# EAGLE schematic ADAT DeEnkoder v2 (EAGLE 5.03)
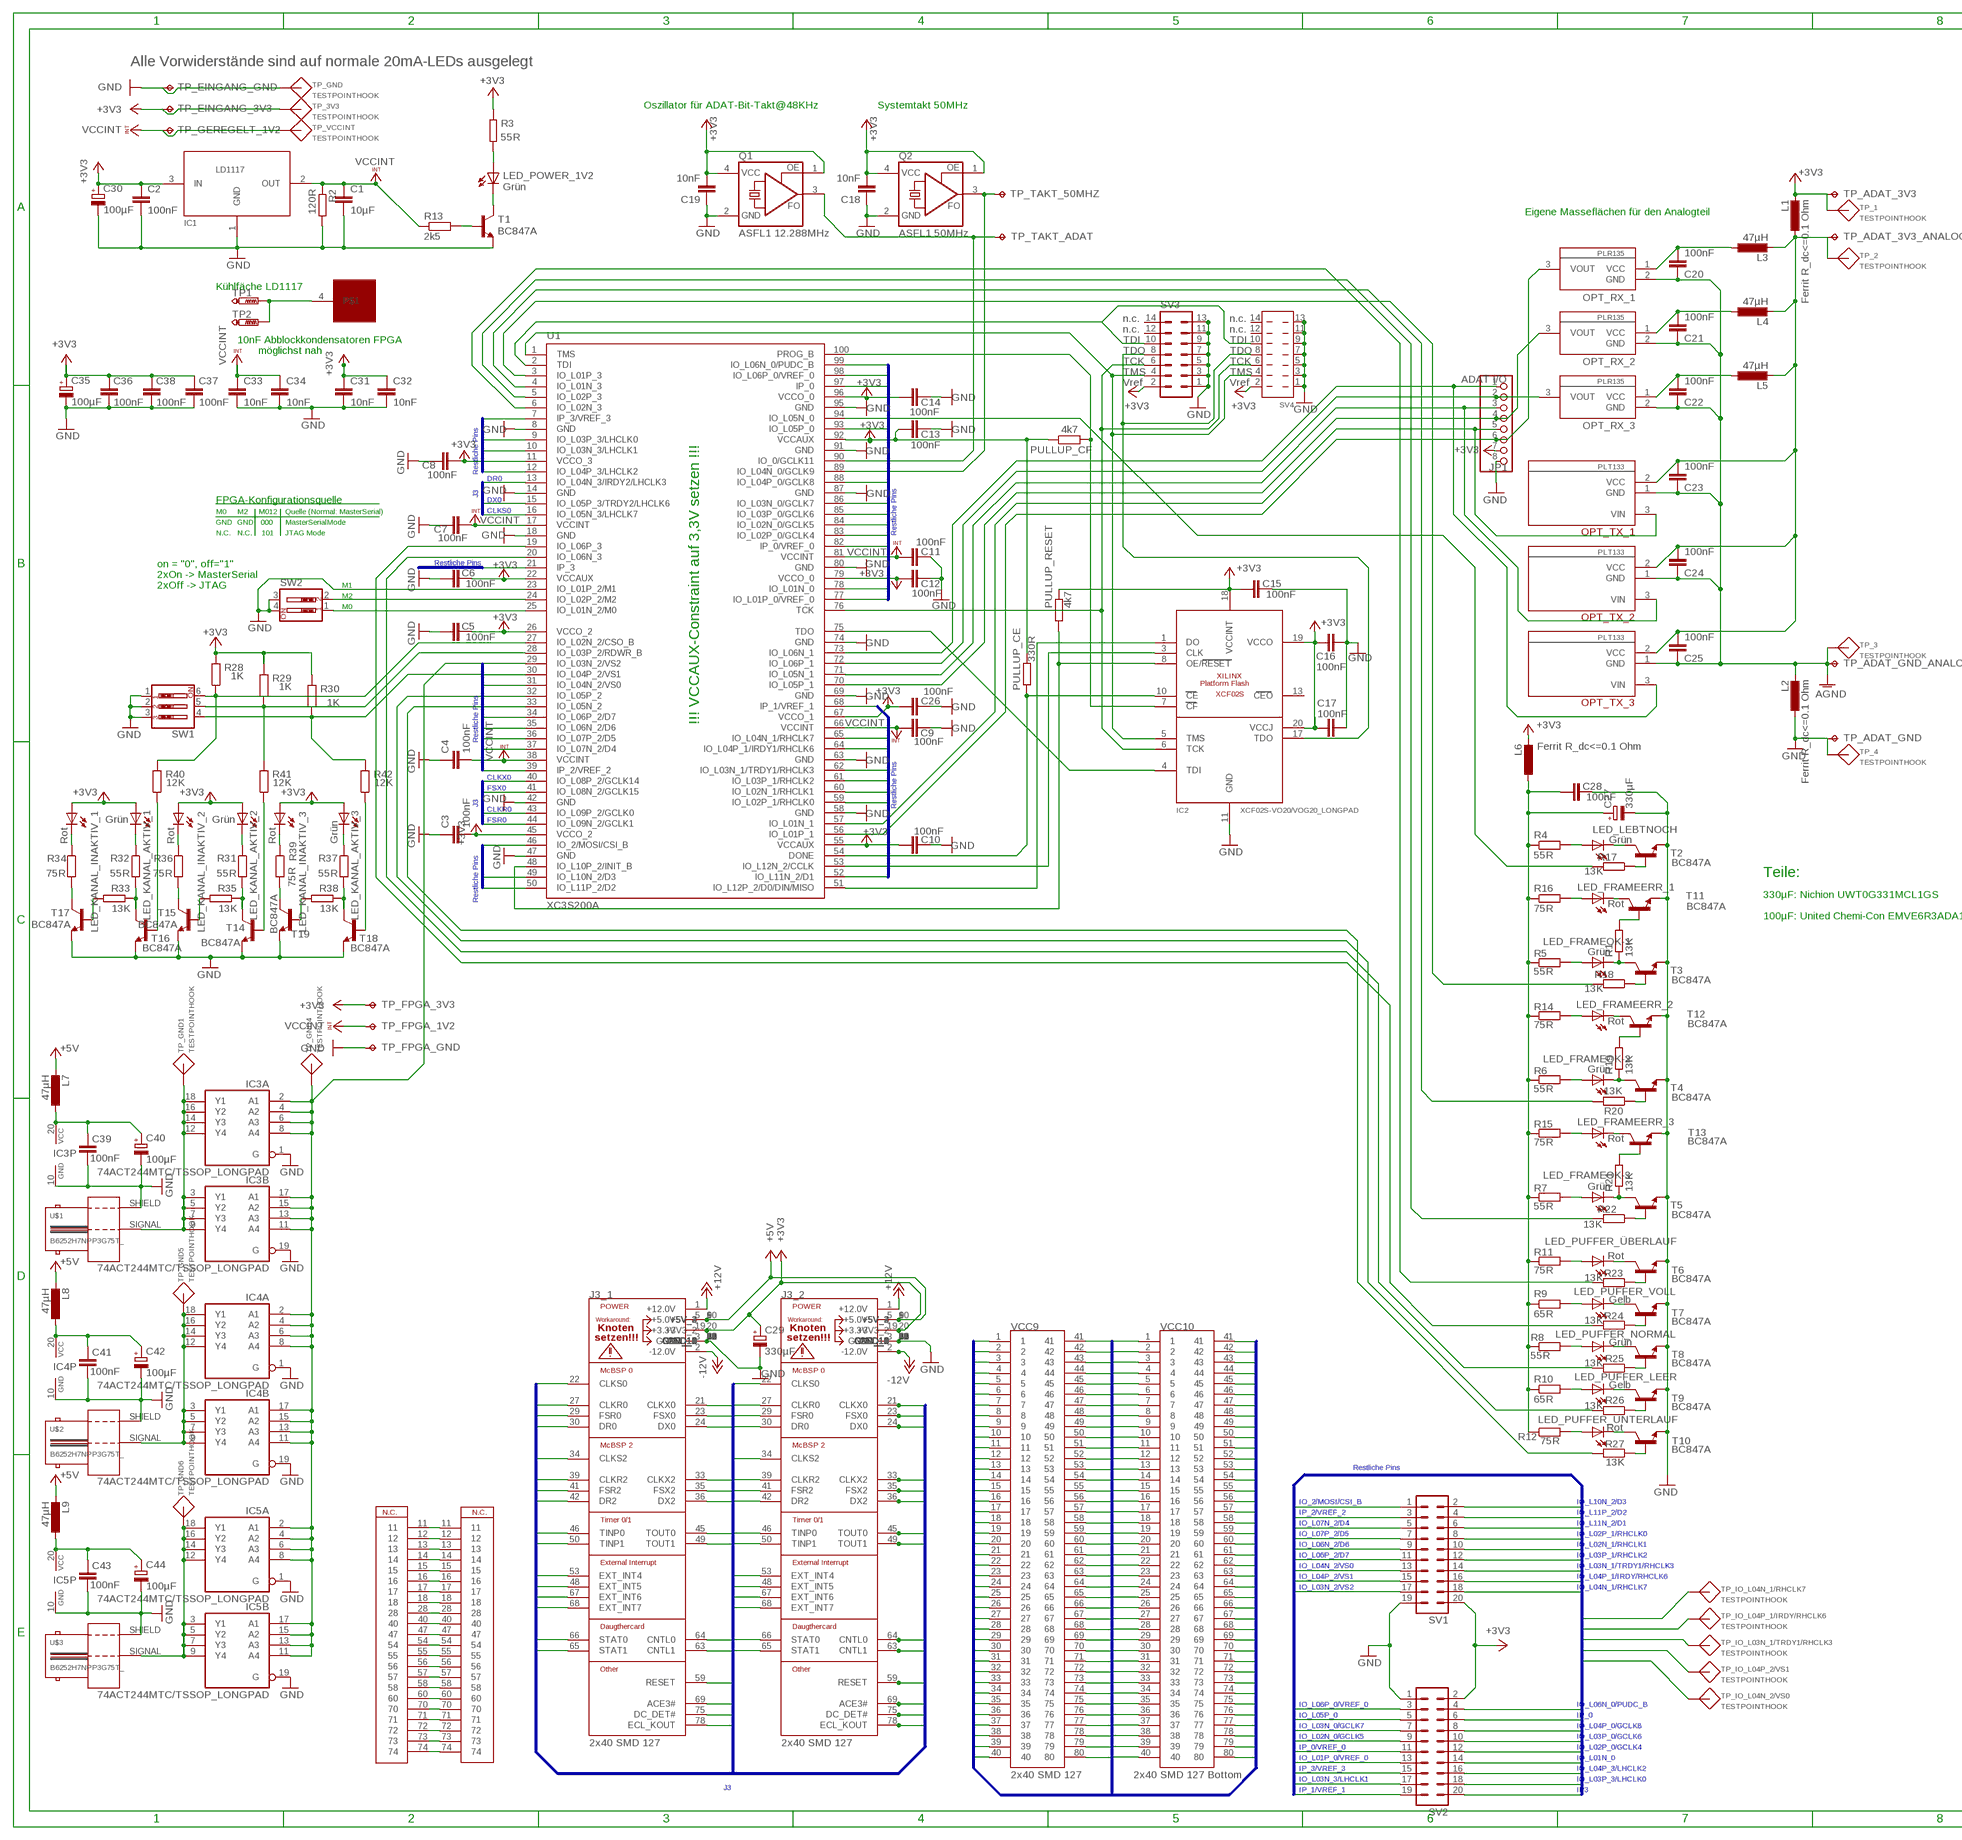
[diagram p0: schematic, sheet 1, part 1 of 2]
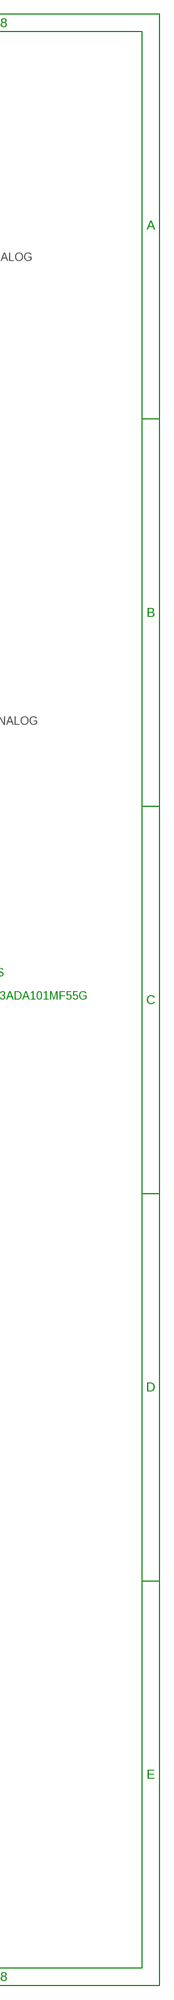
[diagram p1: schematic, sheet 1, part 2 of 2]

## Parts
C1  10µF  C-EUC0805  [C0805]
C2  100nF  C-EUC0603  [C0603]
C3  100nF  C-EUC0603  [C0603]
C4  100nF  C-EUC0603  [C0603]
C5  100nF  C-EUC0603  [C0603]
C6  100nF  C-EUC0603  [C0603]
C7  100nF  C-EUC0603  [C0603]
C8  100nF  C-EUC0603  [C0603]
C9  100nF  C-EUC0603  [C0603]
C10  100nF  C-EUC0603  [C0603]
C11  100nF  C-EUC0603  [C0603]
C12  100nF  C-EUC0603  [C0603]
C13  100nF  C-EUC0603  [C0603]
C14  100nF  C-EUC0603  [C0603]
C15  100nF  C-EUC0603  [C0603]
C16  100nF  C-EUC0603  [C0603]
C17  100nF  C-EUC0603  [C0603]
C18  10nF  C-EUC0603  [C0603]
C19  10nF  C-EUC0603  [C0603]
C20  100nF  C-EUC0603  [C0603]
C21  100nF  C-EUC0603  [C0603]
C22  100nF  C-EUC0603  [C0603]
C23  100nF  C-EUC0603  [C0603]
C24  100nF  C-EUC0603  [C0603]
C25  100nF  C-EUC0603  [C0603]
C26  100nF  C-EUC0603  [C0603]
C27  330µF  ELKO-SMDLONG_PADS  [6.3²_LONGPADS]
C28  100nF  C-EUC0603  [C0603]
C29  330µF  ELKO-SMDLONG_PADS  [6.3²_LONGPADS]
C30  100µF  ELKO-SMD6.3MM  [6.3²]
C31  10nF  C-EUC0603  [C0603]
C32  10nF  C-EUC0603  [C0603]
C33  10nF  C-EUC0603  [C0603]
C34  10nF  C-EUC0603  [C0603]
C35  100µF  ELKO-SMDLONG_PADS  [6.3²_LONGPADS]
C36  100nF  C-EUC0603  [C0603]
C37  100nF  C-EUC0603  [C0603]
C38  100nF  C-EUC0603  [C0603]
C39  100nF  C-EUC0603  [C0603]
C40  100µF  ELKO-SMDLONG_PADS  [6.3²_LONGPADS]
C41  100nF  C-EUC0603  [C0603]
C42  100µF  ELKO-SMDLONG_PADS  [6.3²_LONGPADS]
C43  100nF  C-EUC0603  [C0603]
C44  100µF  ELKO-SMDLONG_PADS  [6.3²_LONGPADS]
IC1  LD1117S  [SOT223]
IC2  XCF02S-VO20/VOG20_LONGPAD  [TSSOP20_LONGPAD]
IC3  74ACT244MTC/TSSOP_LONGPAD  [TSSOP20_LONGPAD]
IC4  74ACT244MTC/TSSOP_LONGPAD  [TSSOP20_LONGPAD]
IC5  74ACT244MTC/TSSOP_LONGPAD  [TSSOP20_LONGPAD]
J3_1  J3_2X40SMD127_TOP  [J3_2X40SMD_TOP]
J3_2  J3_2X40SMD127_BOTTOM  [J3_2X40SMD_BOTTOM]
JP1  ADAT I/O  PINHD-1X8  [1X08]
L1  Ferrit R_dc<=0.1 Ohm  L-EUL2012C  [L2012C]
L2  Ferrit R_dc<=0.1 Ohm  L-EUL2012C  [L2012C]
L3  47µH  L-EU2518_(1007_IMP)_LONGPAD  [1007_(2518METR.)_LONGPAD]
L4  47µH  L-EU2518_(1007_IMP)_LONGPAD  [1007_(2518METR.)_LONGPAD]
L5  47µH  L-EU2518_(1007_IMP)_LONGPAD  [1007_(2518METR.)_LONGPAD]
L6  Ferrit R_dc<=0.1 Ohm  L-EUL2012C  [L2012C]
L7  47µH  L-EU2518_(1007_IMP)_LONGPAD  [1007_(2518METR.)_LONGPAD]
L8  47µH  L-EU2518_(1007_IMP)_LONGPAD  [1007_(2518METR.)_LONGPAD]
L9  47µH  L-EU2518_(1007_IMP)_LONGPAD  [1007_(2518METR.)_LONGPAD]
LED_FRAMEERR_1  Rot  LEDCHIPLED_0805  [CHIPLED_0805]
LED_FRAMEERR_2  Rot  LEDCHIPLED_0805  [CHIPLED_0805]
LED_FRAMEERR_3  Rot  LEDCHIPLED_0805  [CHIPLED_0805]
LED_FRAMEOK-1  Grün  LEDCHIPLED_0805  [CHIPLED_0805]
LED_FRAMEOK-2  Grün  LEDCHIPLED_0805  [CHIPLED_0805]
LED_FRAMEOK-3  Grün  LEDCHIPLED_0805  [CHIPLED_0805]
LED_KANAL_AKTIV_1  Grün  LEDCHIPLED_0805  [CHIPLED_0805]
LED_KANAL_AKTIV_2  Grün  LEDCHIPLED_0805  [CHIPLED_0805]
LED_KANAL_AKTIV_3  Grün  LEDCHIPLED_0805  [CHIPLED_0805]
LED_KANAL_INAKTIV_1  Rot  LEDCHIPLED_0805  [CHIPLED_0805]
LED_KANAL_INAKTIV_2  Rot  LEDCHIPLED_0805  [CHIPLED_0805]
LED_KANAL_INAKTIV_3  Rot  LEDCHIPLED_0805  [CHIPLED_0805]
LED_LEBTNOCH  Grün  LEDCHIPLED_0805  [CHIPLED_0805]
LED_POWER_1V2  Grün  LEDCHIPLED_0805  [CHIPLED_0805]
LED_PUFFER_LEER  Gelb  LEDCHIPLED_0805  [CHIPLED_0805]
LED_PUFFER_NORMAL  Grün  LEDCHIPLED_0805  [CHIPLED_0805]
LED_PUFFER_UNTERLAUF  Rot  LEDCHIPLED_0805  [CHIPLED_0805]
LED_PUFFER_VOLL  Gelb  LEDCHIPLED_0805  [CHIPLED_0805]
LED_PUFFER_ÜBERLAUF  Rot  LEDCHIPLED_0805  [CHIPLED_0805]
OPT_RX_1  PLR135/T  [T]
OPT_RX_2  PLR135/T  [T]
OPT_RX_3  PLR135/T  [T]
OPT_TX_1  PLT133  [PLT133]
OPT_TX_2  PLT133  [PLT133]
OPT_TX_3  PLT133  [PLT133]
PULLUP_CE  330R  R-EU_R0805  [R0805]
PULLUP_CF  4k7  R-EU_R0805  [R0805]
PULLUP_RESET  4k7  R-EU_R0805  [R0805]
Q1  ASFL1 12.288MHz  ASFL1  [ASF]
Q2  ASFL1 50MHz  ASFL1  [ASF]
R1  13K  R-EU_R0805  [R0805]
R2  120R  R-EU_R0805  [R0805]
R3  55R  R-EU_R0805  [R0805]
R4  55R  R-EU_R0805  [R0805]
R5  55R  R-EU_R0805  [R0805]
R6  55R  R-EU_R0805  [R0805]
R7  55R  R-EU_R0805  [R0805]
R8  55R  R-EU_R0805  [R0805]
R9  65R  R-EU_R0805  [R0805]
R10  65R  R-EU_R0805  [R0805]
R11  75R  R-EU_R0805  [R0805]
R12  75R  R-EU_R0805  [R0805]
R13  2k5  R-EU_R0805  [R0805]
R14  75R  R-EU_R0805  [R0805]
R15  75R  R-EU_R0805  [R0805]
R16  75R  R-EU_R0805  [R0805]
R17  13K  R-EU_R0805  [R0805]
R18  13K  R-EU_R0805  [R0805]
R19  13K  R-EU_R0805  [R0805]
R20  13K  R-EU_R0805  [R0805]
R21  13K  R-EU_R0805  [R0805]
R22  13K  R-EU_R0805  [R0805]
R23  13K  R-EU_R0805  [R0805]
R24  13K  R-EU_R0805  [R0805]
R25  13K  R-EU_R0805  [R0805]
R26  13K  R-EU_R0805  [R0805]
R27  13K  R-EU_R0805  [R0805]
R28  1K  R-EU_R0805  [R0805]
R29  1K  R-EU_R0805  [R0805]
R30  1K  R-EU_R0805  [R0805]
R31  55R  R-EU_R0805  [R0805]
R32  55R  R-EU_R0805  [R0805]
R33  13K  R-EU_R0805  [R0805]
R34  75R  R-EU_R0805  [R0805]
R35  13K  R-EU_R0805  [R0805]
R36  75R  R-EU_R0805  [R0805]
R37  55R  R-EU_R0805  [R0805]
R38  13K  R-EU_R0805  [R0805]
R39  75R  R-EU_R0805  [R0805]
R40  12K  R-EU_R0805  [R0805]
R41  12K  R-EU_R0805  [R0805]
R42  12K  R-EU_R0805  [R0805]
SV1  ML20_ROUND-PADS  [ML20_ROUND_PAD]
SV2  ML20_ROUND-PADS  [ML20_ROUND_PAD]
SV3  ML14_RUNDE-PINS  [ML14_ROUND_PAD]
SV4  87831-1420  [87831-1420]
SW1  SW_DIP-3  [EDG-03]
SW2  SW_DIP-2  [EDG-02]
T1  BC847A  BC847  [SOT23]
T2  BC847A  BC847  [SOT23]
T3  BC847A  BC847  [SOT23]
T4  BC847A  BC847  [SOT23]
T5  BC847A  BC847  [SOT23]
T6  BC847A  BC847  [SOT23]
T7  BC847A  BC847  [SOT23]
T8  BC847A  BC847  [SOT23]
T9  BC847A  BC847  [SOT23]
T10  BC847A  BC847  [SOT23]
T11  BC847A  BC847  [SOT23]
T12  BC847A  BC847  [SOT23]
T13  BC847A  BC847  [SOT23]
T14  BC847A  BC847  [SOT23]
T15  BC847A  BC847  [SOT23]
T16  BC847A  BC847  [SOT23]
T17  BC847A  BC847  [SOT23]
T18  BC847A  BC847  [SOT23]
T19  BC847A  BC847  [SOT23]
TP1  PTR1PAD1-20  [P1-20]
TP2  PTR1PAD1-20  [P1-20]
TP_1  TESTPOINTHOOK  [TESTPOINT-HOOK]
TP_2  TESTPOINTHOOK  [TESTPOINT-HOOK]
TP_3  TESTPOINTHOOK  [TESTPOINT-HOOK]
TP_3V3  TESTPOINTHOOK  [TESTPOINT-HOOK]
TP_4  TESTPOINTHOOK  [TESTPOINT-HOOK]
TP_ADAT_3V3  TPB2,54  [B2,54]
TP_ADAT_3V3_ANALOG  TPB2,54  [B2,54]
TP_ADAT_GND  TPB2,54  [B2,54]
TP_ADAT_GND_ANALOG  TPB2,54  [B2,54]
TP_EINGANG_3V3  TPB2,54  [B2,54]
TP_EINGANG_GND  TPB2,54  [B2,54]
TP_FPGA_1V2  TPB2,54  [B2,54]
TP_FPGA_3V3  TPB2,54  [B2,54]
TP_FPGA_GND  TPB2,54  [B2,54]
TP_GEREGELT_1V2  TPB2,54  [B2,54]
TP_GND  TESTPOINTHOOK  [TESTPOINT-HOOK]
TP_GND1  TESTPOINTHOOK  [TESTPOINT-HOOK]
TP_GND4  TESTPOINTHOOK  [TESTPOINT-HOOK]
TP_GND5  TESTPOINTHOOK  [TESTPOINT-HOOK]
TP_GND6  TESTPOINTHOOK  [TESTPOINT-HOOK]
TP_IO_L03N_1/TRDY1/RHCLK3  TESTPOINTHOOK  [TESTPOINT-HOOK]
TP_IO_L04N_1/RHCLK7  TESTPOINTHOOK  [TESTPOINT-HOOK]
TP_IO_L04N_2/VS0  TESTPOINTHOOK  [TESTPOINT-HOOK]
TP_IO_L04P_1/IRDY/RHCLK6  TESTPOINTHOOK  [TESTPOINT-HOOK]
TP_IO_L04P_2/VS1  TESTPOINTHOOK  [TESTPOINT-HOOK]
TP_TAKT_50MHZ  TPTP07SQ  [TP07SQ]
TP_TAKT_ADAT  TPTP07SQ  [TP07SQ]
TP_VCCINT  TESTPOINTHOOK  [TESTPOINT-HOOK]
U1  XC3S200A  [S-PQFP-G100]
U$1  B6252H7NPP3G75T_  [1-1634624-0]
U$2  B6252H7NPP3G75T_  [1-1634624-0]
U$3  B6252H7NPP3G75T_  [1-1634624-0]
VCC9  PINHEAD_2X40SMD127  [PINHEAD_2X40SMD]
VCC10  PINHEAD_2X40SMD127BOTTOM  [PINHEAD_2X40SMDBOTTOM]

## Nets
3.3V_LED: C27.+ C28.2 L6.1 R4.1 R5.1 R6.1 R7.1 R8.1 R9.1 R10.1 R11.1 R12.1 R14.1 R15.1 R16.1
+3V3: C2.1 C3.2 C5.2 C6.2 C8.2 C10.1 C12.1 C13.1 C14.1 C15.1 C16.2 C17.2 C18.2 C19.2 C26.1 C29.+ C30.+ C31.1 C32.1 C35.+ C36.1 C37.1 C38.1 IC1.3(IN) IC2.18(VCCINT) IC2.19(VCCO) IC2.20(VCCJ) J3_1.19(+3.3V) J3_1.20(+3V3_2) J3_2.19(+3.3V) J3_2.20(+3V3_2) JP1.7 L1.2 L6.2 LED_KANAL_AKTIV_1.A LED_KANAL_AKTIV_2.A LED_KANAL_AKTIV_3.A LED_KANAL_INAKTIV_1.A LED_KANAL_INAKTIV_2.A LED_KANAL_INAKTIV_3.A PULLUP_CE.2 PULLUP_CF.1 PULLUP_RESET.2 Q1.1(OE) Q1.4(VCC) Q2.1(OE) Q2.4(VCC) R3.1 R28.2 R29.2 R30.2 SV1.20 SV2.2 SV3.2 SV4.2 TP_1.P$1 TP_3V3.P$1 TP_ADAT_3V3.TP TP_EINGANG_3V3.TP TP_FPGA_3V3.TP U1.11(VCCO_3) U1.22(VCCAUX) U1.26(VCCO_2) U1.45(VCCO_2) U1.55(VCCAUX) U1.67(VCCO_1) U1.79(VCCO_0) U1.92(VCCAUX) U1.96(VCCO_0)
+5V: J3_1.5(+5.0V) J3_1.6(+5V_2) J3_1.9(+5V_3) J3_1.10(+5V_4) J3_2.5(+5.0V) J3_2.6(+5V_2) J3_2.9(+5V_3) J3_2.10(+5V_4) L7.P$2 L8.P$2 L9.P$2
+12V: J3_1.1(+12.0V) J3_2.1(+12.0V)
-12V: J3_1.2(-12.0V) J3_2.2(-12.0V)
ACE3#: J3_1.69(ACE3#) J3_2.69(ACE3#)
ADAT_IN_1: JP1.6 OPT_RX_1.3(VOUT) U1.56(IO_L01P_1)
ADAT_IN_2: JP1.4 OPT_RX_2.3(VOUT) U1.70(IO_L05P_1)
ADAT_IN_3: JP1.2 OPT_RX_3.3(VOUT) U1.72(IO_L06P_1)
ADAT_OUT_1: JP1.5 OPT_TX_1.3(VIN) U1.57(IO_L01N_1)
ADAT_OUT_2: JP1.3 OPT_TX_2.3(VIN) U1.71(IO_L05N_1)
ADAT_OUT_3: JP1.1 OPT_TX_3.3(VIN) U1.73(IO_L06N_1)
AGND: C20.1 C21.1 C22.1 C23.1 C24.1 C25.1 L2.2 OPT_RX_1.2(GND) OPT_RX_2.2(GND) OPT_RX_3.2(GND) OPT_TX_1.1(GND) OPT_TX_2.1(GND) OPT_TX_3.1(GND) TP_3.P$1 TP_ADAT_GND_ANALOG.TP
AVCC: C23.2 C24.2 C25.2 L1.1 L3.P$2 L4.P$2 L5.P$2 OPT_TX_1.2(VCC) OPT_TX_2.2(VCC) OPT_TX_3.2(VCC) TP_2.P$1 TP_ADAT_3V3_ANALOG.TP
CLK_50MHZ: Q2.3(FO) TP_TAKT_50MHZ.TP U1.89(IO_L04N_0/GCLK9)
CLK_ADAT_BIT: Q1.3(FO) TP_TAKT_ADAT.TP U1.90(IO_0/GCLK11)
CLKR0: J3_1.27(CLKR0) J3_2.27(CLKR0) U1.43(IO_L09P_2/GCLK0)
CLKR2: J3_1.39(CLKR2) J3_2.39(CLKR2)
CLKS0: J3_1.22(CLKS0) J3_2.22(CLKS0) U1.16(IO_L05N_3/LHCLK7)
CLKS2: J3_1.34(CLKS2) J3_2.34(CLKS2)
CLKX0: J3_1.21(CLKX0) J3_2.21(CLKX0) U1.40(IO_L08P_2/GCLK14)
CLKX2: J3_1.33(CLKX2) J3_2.33(CLKX2)
CNTL0: J3_1.64(CNTL0) J3_2.64(CNTL0)
CNTL1: J3_1.63(CNTL1) J3_2.63(CNTL1)
DC_DET#: J3_1.75(DC_DET#) J3_2.75(DC_DET#)
DR0: J3_1.30(DR0) J3_2.30(DR0) U1.13(IO_L04N_3/IRDY2/LHCLK3)
DR2: J3_1.42(DR2) J3_2.42(DR2)
DX0: J3_1.24(DX0) J3_2.24(DX0) U1.15(IO_L05P_3/TRDY2/LHCLK6)
DX2: J3_1.36(DX2) J3_2.36(DX2)
ECL_KOUT: J3_1.78(ECL_KOUT) J3_2.78(ECL_KOUT)
ESLEBT: R17.2 U1.94(IO_L05N_0)
EXT_INT4: J3_1.53(EXT_INT4) J3_2.53(EXT_INT4)
EXT_INT5: J3_1.48(EXT_INT5) J3_2.48(EXT_INT5)
EXT_INT6: J3_1.67(EXT_INT6) J3_2.67(EXT_INT6)
EXT_INT7: J3_1.68(EXT_INT7) J3_2.68(EXT_INT7)
FRAMEOK1: R18.2 U1.3(IO_L01P_3)
FRAMEOK2: R20.2 U1.4(IO_L01N_3)
FRAMEOK3: R22.2 U1.5(IO_L02P_3)
FSR0: J3_1.29(FSR0) J3_2.29(FSR0) U1.44(IO_L09N_2/GCLK1)
FSR2: J3_1.41(FSR2) J3_2.41(FSR2)
FSX0: J3_1.23(FSX0) J3_2.23(FSX0) U1.41(IO_L08N_2/GCLK15)
FSX2: J3_1.35(FSX2) J3_2.35(FSX2)
GND: C1.2 C2.2 C3.1 C4.1 C5.1 C6.1 C7.1 C8.1 C9.2 C10.2 C11.2 C12.2 C13.2 C14.2 C15.2 C16.1 C17.1 C18.1 C19.1 C26.2 C27.- C28.1 C29.- C30.- C31.2 C32.2 C33.2 C34.2 C35.- C36.2 C37.2 C38.2 C39.1 C40.- C41.1 C42.- C43.1 C44.- IC1.1(GND) IC2.11(GND) IC3.1(A:G) IC3.10(P:GND) IC3.19(B:G) IC4.1(A:G) IC4.10(P:GND) IC4.19(B:G) IC5.1(A:G) IC5.10(P:GND) IC5.19(B:G) J3_1.3(GND) J3_1.4(GND_1) J3_1.7(GND_2) J3_1.8(GND_3) J3_1.25(GND_4) J3_1.26(GND_5) J3_1.31(GND_6) J3_1.32(GND_7) J3_1.37(GND_8) J3_1.38(GND_9) J3_1.43(GND_10) J3_1.44(GND_11) J3_1.51(GND_12) J3_1.52(GND_13) J3_1.61(GND_14) J3_1.62(GND_15) J3_1.76(GND_16) J3_1.77(GND_17) J3_1.79(GND_18) J3_1.80(GND_19) J3_2.3(GND) J3_2.4(GND_1) J3_2.7(GND_2) J3_2.8(GND_3) J3_2.25(GND_4) J3_2.26(GND_5) J3_2.31(GND_6) J3_2.32(GND_7) J3_2.37(GND_8) J3_2.38(GND_9) J3_2.43(GND_10) J3_2.44(GND_11) J3_2.51(GND_12) J3_2.52(GND_13) J3_2.61(GND_14) J3_2.62(GND_15) J3_2.76(GND_16) J3_2.77(GND_17) J3_2.79(GND_18) J3_2.80(GND_19) JP1.8 L2.1 Q1.2(GND) Q2.2(GND) R2.2 SV1.19 SV2.1 SV3.1 SV3.3 SV3.5 SV3.7 SV3.9 SV3.11 SV3.13 SV4.1 SV4.3 SV4.5 SV4.7 SV4.9 SV4.11 SV4.13 SW1.1 SW1.2 SW1.3 SW2.3 SW2.4 T1.2(E) T2.2(E) T3.2(E) T4.2(E) T5.2(E) T6.2(E) T7.2(E) T8.2(E) T9.2(E) T10.2(E) T11.2(E) T12.2(E) T13.2(E) T14.2(E) T15.2(E) T16.2(E) T17.2(E) T18.2(E) T19.2(E) TP_4.P$1 TP_ADAT_GND.TP TP_EINGANG_GND.TP TP_FPGA_GND.TP TP_GND.P$1 U1.8(GND) U1.14(GND) U1.18(GND) U1.23(IO_L01P_2/M1) U1.42(GND) U1.47(GND) U1.58(GND) U1.63(GND) U1.69(GND) U1.74(GND) U1.80(GND) U1.87(GND) U1.91(GND) U1.95(GND) U$1.SHIELD U$2.SHIELD U$3.SHIELD
IO_2/MOSI/CSI_B: SV1.1 U1.46(IO_2/MOSI/CSI_B)
IO_L01N_0: SV2.14 U1.78(IO_L01N_0)
IO_L01P_0/VREF_0: SV2.13 U1.77(IO_L01P_0/VREF_0)
IO_L02N_0/GCLK5: SV2.9 U1.84(IO_L02N_0/GCLK5)
IO_L02N_1/RHCLK1: SV1.10 U1.60(IO_L02N_1/RHCLK1)
IO_L02P_0/GCLK4: SV2.12 U1.83(IO_L02P_0/GCLK4)
IO_L02P_1/RHCLK0: SV1.8 U1.59(IO_L02P_1/RHCLK0)
IO_L03N_0/GCLK7: SV2.7 U1.86(IO_L03N_0/GCLK7)
IO_L03N_1/TRDY1/RHCLK3: SV1.14 TP_IO_L03N_1/TRDY1/RHCLK3.P$1 U1.62(IO_L03N_1/TRDY1/RHCLK3)
IO_L03N_2/VS2: IC3.2(A:A1) IC3.4(A:A2) IC3.6(A:A3) IC3.8(A:A4) IC3.11(B:A4) IC3.13(B:A3) IC3.15(B:A2) IC3.17(B:A1) IC4.2(A:A1) IC4.4(A:A2) IC4.6(A:A3) IC4.8(A:A4) IC4.11(B:A4) IC4.13(B:A3) IC4.15(B:A2) IC4.17(B:A1) IC5.2(A:A1) IC5.4(A:A2) IC5.6(A:A3) IC5.8(A:A4) IC5.11(B:A4) IC5.13(B:A3) IC5.15(B:A2) IC5.17(B:A1) SV1.17 TP_GND4.P$1 U1.29(IO_L03N_2/VS2)
IO_L03N_3/LHCLK1: SV2.17 U1.10(IO_L03N_3/LHCLK1)
IO_L03P_0/GCLK6: SV2.10 U1.85(IO_L03P_0/GCLK6)
IO_L03P_1/RHCLK2: SV1.12 U1.61(IO_L03P_1/RHCLK2)
IO_L03P_3/LHCLK0: SV2.18 U1.9(IO_L03P_3/LHCLK0)
IO_L04N_1/RHCLK7: SV1.18 TP_IO_L04N_1/RHCLK7.P$1 U1.65(IO_L04N_1/RHCLK7)
IO_L04N_2/VS0: SV1.13 TP_IO_L04N_2/VS0.P$1 U1.31(IO_L04N_2/VS0)
IO_L04P_0/GCLK8: SV2.8 U1.88(IO_L04P_0/GCLK8)
IO_L04P_1/IRDY/RHCLK6: SV1.16 TP_IO_L04P_1/IRDY/RHCLK6.P$1 U1.64(IO_L04P_1/IRDY1/RHCLK6)
IO_L04P_2/VS1: R30.1 R42.2 SV1.15 SW1.4 TP_IO_L04P_2/VS1.P$1 U1.30(IO_L04P_2/VS1)
IO_L04P_3/LHCLK2: SV2.16 U1.12(IO_L04P_3/LHCLK2)
IO_L05P_0: SV2.5 U1.93(IO_L05P_0)
IO_L06N_0/PUDC_B: SV2.4 U1.99(IO_L06N_0/PUDC_B)
IO_L06N_2/D6: SV1.9 U1.35(IO_L06N_2/D6)
IO_L06P_0/VREF_0: SV2.3 U1.98(IO_L06P_0/VREF_0)
IO_L06P_2/D7: SV1.11 U1.34(IO_L06P_2/D7)
IO_L07N_2/D4: SV1.5 U1.37(IO_L07N_2/D4)
IO_L07P_2/D5: SV1.7 U1.36(IO_L07P_2/D5)
IO_L10N_2/D3: SV1.2 U1.49(IO_L10N_2/D3)
IO_L11N_2/D1: SV1.6 U1.52(IO_L11N_2/D1)
IO_L11P_2/D2: SV1.4 U1.50(IO_L11P_2/D2)
IP3: SV2.20 U1.21(IP_3)
IP_0: SV2.6 U1.97(IP_0)
IP_0/VREF_0: SV2.11 U1.82(IP_0/VREF_0)
IP_1/VREF_1: SV2.19 U1.68(IP_1/VREF_1)
IP_2/VREF_2: SV1.3 U1.39(IP_2/VREF_2)
IP_3/VREF_3: SV2.15 U1.7(IP_3/VREF_3)
J4B1: VCC9.1 VCC10.1
J4B2: VCC9.2 VCC10.2
J4B3: VCC9.3 VCC10.3
J4B4: VCC9.4 VCC10.4
J4B5: VCC9.5 VCC10.5
J4B6: VCC9.6 VCC10.6
J4B7: VCC9.7 VCC10.7
J4B8: VCC9.8 VCC10.8
J4B9: VCC9.9 VCC10.9
J4B10: VCC9.10 VCC10.10
J4B11: VCC9.11 VCC10.11
J4B12: VCC9.12 VCC10.12
J4B13: VCC9.13 VCC10.13
J4B14: VCC9.14 VCC10.14
J4B15: VCC9.15 VCC10.15
J4B16: VCC9.16 VCC10.16
J4B17: VCC9.17 VCC10.17
J4B18: VCC9.18 VCC10.18
J4B19: VCC9.19 VCC10.19
J4B20: VCC9.20 VCC10.20
J4B21: VCC9.21 VCC10.21
J4B22: VCC9.22 VCC10.22
J4B23: VCC9.23 VCC10.23
J4B24: VCC9.24 VCC10.24
J4B25: VCC9.25 VCC10.25
J4B26: VCC9.26 VCC10.26
J4B27: VCC9.27 VCC10.27
J4B28: VCC9.28 VCC10.28
J4B29: VCC9.29 VCC10.29
J4B30: VCC9.30 VCC10.30
J4B31: VCC9.31 VCC10.31
J4B32: VCC9.32 VCC10.32
J4B33: VCC9.33 VCC10.33
J4B34: VCC9.34 VCC10.34
J4B35: VCC9.35 VCC10.35
J4B36: VCC9.36 VCC10.36
J4B37: VCC9.37 VCC10.37
J4B38: VCC9.38 VCC10.38
J4B39: VCC9.39 VCC10.39
J4B40: VCC9.40 VCC10.40
J4B41: VCC9.41 VCC10.41
J4B42: VCC9.42 VCC10.42
J4B43: VCC9.43 VCC10.43
J4B44: VCC9.44 VCC10.44
J4B45: VCC9.45 VCC10.45
J4B46: VCC9.46 VCC10.46
J4B47: VCC9.47 VCC10.47
J4B48: VCC9.48 VCC10.48
J4B49: VCC9.49 VCC10.49
J4B50: VCC9.50 VCC10.50
J4B51: VCC9.51 VCC10.51
J4B52: VCC9.52 VCC10.52
J4B53: VCC9.53 VCC10.53
J4B54: VCC9.54 VCC10.54
J4B55: VCC9.55 VCC10.55
J4B56: VCC9.56 VCC10.56
J4B57: VCC9.57 VCC10.57
J4B58: VCC9.58 VCC10.58
J4B59: VCC9.59 VCC10.59
J4B60: VCC9.60 VCC10.60
J4B61: VCC9.61 VCC10.61
J4B62: VCC9.62 VCC10.62
J4B63: VCC9.63 VCC10.63
J4B64: VCC9.64 VCC10.64
J4B65: VCC9.65 VCC10.65
J4B66: VCC9.66 VCC10.66
J4B67: VCC9.67 VCC10.67
J4B68: VCC9.68 VCC10.68
J4B69: VCC9.69 VCC10.69
J4B70: VCC9.70 VCC10.70
J4B71: VCC9.71 VCC10.71
J4B72: VCC9.72 VCC10.72
J4B73: VCC9.73 VCC10.73
J4B74: VCC9.74 VCC10.74
J4B75: VCC9.75 VCC10.75
J4B76: VCC9.76 VCC10.76
J4B77: VCC9.77 VCC10.77
J4B78: VCC9.78 VCC10.78
J4B79: VCC9.79 VCC10.79
J4B80: VCC9.80 VCC10.80
LD1117_KUEHLUNG: IC1.4 TP1.TP TP2.TP
M0: SW2.1 U1.25(IO_L01N_2/M0)
M2: SW2.2 U1.24(IO_L02P_2/M2)
N$1: IC2.1(DO) U1.51(IO_L12P_2/D0/DIN/MISO)
N$2: IC2.3(CLK) U1.53(IO_L12N_2/CCLK)
N$3: IC2.8(OE/RESET) PULLUP_RESET.1 U1.48(IO_L10P_2/INIT_B)
N$4: J3_1.11 J3_2.11
N$5: IC2.10(CE) PULLUP_CE.1 U1.54(DONE)
N$6: LED_LEBTNOCH.C T2.3(C)
N$7: R29.1 R41.2 SW1.5 U1.28(IO_L03P_2/RDWR_B)
N$8: J3_1.12 J3_2.12
N$9: J3_1.13 J3_2.13
N$10: J3_1.14 J3_2.14
N$11: J3_1.15 J3_2.15
N$12: LED_FRAMEOK-1.C R1.1 T3.3(C)
N$13: LED_FRAMEOK-2.C R19.1 T4.3(C)
N$14: R13.2 T1.1(B)
N$15: LED_POWER_1V2.C T1.3(C)
N$16: LED_POWER_1V2.A R3.2
N$17: LED_PUFFER_ÜBERLAUF.C T6.3(C)
N$18: LED_PUFFER_VOLL.C T7.3(C)
N$19: LED_PUFFER_NORMAL.C T8.3(C)
N$20: C20.2 L3.P$1 OPT_RX_1.1(VCC)
N$21: C21.2 L4.P$1 OPT_RX_2.1(VCC)
N$22: C22.2 L5.P$1 OPT_RX_3.1(VCC)
N$23: LED_PUFFER_LEER.C T9.3(C)
N$24: LED_PUFFER_UNTERLAUF.C T10.3(C)
N$25: LED_LEBTNOCH.A R4.2
N$26: LED_FRAMEOK-3.C R21.1 T5.3(C)
N$27: LED_FRAMEOK-1.A R5.2
N$28: LED_FRAMEOK-2.A R6.2
N$29: LED_FRAMEOK-3.A R7.2
N$30: LED_PUFFER_NORMAL.A R8.2
N$31: LED_PUFFER_VOLL.A R9.2
N$32: LED_PUFFER_LEER.A R10.2
N$33: LED_PUFFER_ÜBERLAUF.A R11.2
N$34: LED_PUFFER_UNTERLAUF.A R12.2
N$35: R1.2 T11.1(B)
N$36: LED_FRAMEERR_3.C T13.3(C)
N$37: LED_FRAMEERR_2.C T12.3(C)
N$38: LED_FRAMEERR_2.A R14.2
N$39: LED_FRAMEERR_1.C T11.3(C)
N$40: LED_FRAMEERR_3.A R15.2
N$41: LED_FRAMEERR_1.A R16.2
N$42: R17.1 T2.1(B)
N$43: R18.1 T3.1(B)
N$44: R19.2 T12.1(B)
N$45: R20.1 T4.1(B)
N$46: R22.1 T5.1(B)
N$47: R21.2 T13.1(B)
N$48: R23.1 T6.1(B)
N$49: R24.1 T7.1(B)
N$50: R25.1 T8.1(B)
N$51: R26.1 T9.1(B)
N$52: R27.1 T10.1(B)
N$53: R28.1 R40.2 SW1.6 U1.27(IO_L02N_2/CSO_B)
N$54: R40.1 T16.1(B)
N$55: J3_1.16 J3_2.16
N$56: R31.2 R35.1 T14.3(C)
N$58: LED_KANAL_INAKTIV_2.C R36.1
N$59: R35.2 T15.1(B)
N$60: R36.2 T15.3(C)
N$61: LED_KANAL_AKTIV_2.C R31.1
N$62: R41.1 T14.1(B)
N$63: J3_1.17 J3_2.17
N$64: J3_1.18 J3_2.18
N$65: J3_1.28 J3_2.28
N$66: J3_1.40 J3_2.40
N$67: J3_1.47 J3_2.47
N$68: J3_1.54 J3_2.54
N$69: J3_1.55 J3_2.55
N$70: J3_1.56 J3_2.56
N$71: J3_1.57 J3_2.57
N$72: J3_1.58 J3_2.58
N$73: J3_1.60 J3_2.60
N$74: J3_1.70 J3_2.70
N$75: J3_1.71 J3_2.71
N$76: J3_1.72 J3_2.72
N$77: J3_1.73 J3_2.73
N$78: J3_1.74 J3_2.74
N$80: R32.2 R33.1 T16.3(C)
N$81: IC3.3(B:Y1) IC3.5(B:Y2) IC3.7(B:Y3) IC3.9(B:Y4) IC3.12(A:Y4) IC3.14(A:Y3) IC3.16(A:Y2) IC3.18(A:Y1) TP_GND1.P$1 U$1.SIGNAL
N$82: R37.2 R38.1 T18.3(C)
N$83: IC4.3(B:Y1) IC4.5(B:Y2) IC4.7(B:Y3) IC4.9(B:Y4) IC4.12(A:Y4) IC4.14(A:Y3) IC4.16(A:Y2) IC4.18(A:Y1) TP_GND5.P$1 U$2.SIGNAL
N$84: LED_KANAL_INAKTIV_1.C R34.1
N$85: IC5.3(B:Y1) IC5.5(B:Y2) IC5.7(B:Y3) IC5.9(B:Y4) IC5.12(A:Y4) IC5.14(A:Y3) IC5.16(A:Y2) IC5.18(A:Y1) TP_GND6.P$1 U$3.SIGNAL
N$86: R33.2 T17.1(B)
N$87: R34.2 T17.3(C)
N$88: LED_KANAL_AKTIV_1.C R32.1
N$89: LED_KANAL_INAKTIV_3.C R39.1
N$90: R38.2 T19.1(B)
N$91: R39.2 T19.3(C)
N$92: LED_KANAL_AKTIV_3.C R37.1
N$95: R42.1 T18.1(B)
N$111: C39.2 C40.+ IC3.20(P:VCC) L7.P$1
N$112: C41.2 C42.+ IC4.20(P:VCC) L8.P$1
N$113: C43.2 C44.+ IC5.20(P:VCC) L9.P$1
PROGB: IC2.7(CF) PULLUP_CF.2 U1.100(PROG_B)
PUFFERLEER: R26.2 U1.32(IO_L05P_2)
PUFFERNORMAL: R25.2 U1.20(IO_L06N_3)
PUFFERUNTERLAUF: R27.2 U1.33(IO_L05N_2)
PUFFERVOLL: R24.2 U1.19(IO_L06P_3)
PUFFERÜBERLAUF: R23.2 U1.6(IO_L02N_3)
RESET: J3_1.59(RESET) J3_2.59(RESET)
STAT0: J3_1.66(STAT0) J3_2.66(STAT0)
STAT1: J3_1.65(STAT1) J3_2.65(STAT1)
TCK: IC2.6(TCK) SV3.6 SV4.6 U1.76(TCK)
TDI: SV3.10 SV4.10 U1.2(TDI)
TDO: IC2.17(TDO) SV3.8 SV4.8
TDO-FPGA__TDI-FLASH: IC2.4(TDI) U1.75(TDO)
TINP0: J3_1.46(TINP0) J3_2.46(TINP0)
TINP1: J3_1.50(TINP1) J3_2.50(TINP1)
TMS: IC2.5(TMS) SV3.4 SV4.4 U1.1(TMS)
TOUT0: J3_1.45(TOUT0) J3_2.45(TOUT0)
TOUT1: J3_1.49(TOUT1) J3_2.49(TOUT1)
VCCINT: C1.1 C4.2 C7.2 C9.1 C11.1 C33.1 C34.1 IC1.2(OUT) R2.1 R13.1 TP_FPGA_1V2.TP TP_GEREGELT_1V2.TP TP_VCCINT.P$1 U1.17(VCCINT) U1.38(VCCINT) U1.66(VCCINT) U1.81(VCCINT)
Unconnected: IC2.13(CEO) SV3.12 SV3.14 SV4.12 SV4.14

## Buses
J3:CLKS0,CLKR0,FSR0,DR0,CLKX0,FSX0,DX0,CLKS2,CLKR2,FSR2,DR2,CLKX2,FSX2,DX2,TINP0,TINP1,TOUT0,TOUT1,EXT_INT4,EXT_INT5,EXT_INT6,EXT_INT7,STAT0,STAT1,CNTL0,CNTL1,RESET,ACE3#,DC_DET#,ECL_KOUT
J4B[1..80]
RESTLICHE_PINS:IP_3/VREF_3,IO_L03P_3/LHCLK0,IO_L03N_3/LHCLK1,IO_L04P_3/LHCLK2,IP3,IO_L03N_2/VS2,IO_L04P_2/VS1,IO_L04N_2/VS0,IO_L06P_2/D7,IO_L06N_2/D6,IO_L07P_2/D5,IO_L07N_2/D4,IP_2/VREF_2,IO_2/MOSI/CSI_B,IO_L10N_2/D3,IO_L11P_2/D2,IO_L11N_2/D1,IO_L02P_1/RHCLK0,IO_L02N_1/RHCLK1,IO_L03P_1/RHCLK2,IO_L03N_1/TRDY1/RHCLK3,IO_L04P_1/IRDY/RHCLK6,IO_L04N_1/RHCLK7,IP_1/VREF_1,IO_L01P_0/VREF_0,IO_L01N_0,IP_0/VREF_0,IO_L02P_0/GCLK4,IO_L02N_0/GCLK5,IO_L03P_0/GCLK6,IO_L03N_0/GCLK7,IO_L04P_0/GCLK8,IO_L05P_0,IO_L05N_0,IP_0,IO_L06P_0/VREF_0,IO_L06N_0/PUDC_B

## Notes on the sheet
- Alle Vorwiderstände sind auf normale 20mA-LEDs ausgelegt
- Oszillator für ADAT-Bit-Takt@48KHz | Systemtakt 50MHz
- Eigene Masseflächen für den Analogteil
- Kühlfäche LD1117
- n.c. | n.c.
- n.c. | n.c.
- 10nF Abblockkondensatoren FPGA | TDI | TDI
- möglichst nah | TDO | TDO
- TCK | TCK
- TMS | TMS
- Vref | Vref
- Restliche Pins
- DR0
- J3
- FPGA-Konfigurationsquelle | DX0
- M0 | M2 | M012 | Quelle (Normal: MasterSerial) | CLKS0
- GND | GND | 000 | MasterSerialMode
- N.C. | N.C. | 101 | JTAG Mode | Restliche Pins
- Restliche Pins
- on = "0", off="1"
- 2xOn -> MasterSerial
- 2xOff -> JTAG | M1
- M2
- M0
- !!! VCCAUX-Constraint auf 3,3V setzen !!!
- Restliche Pins
- CLKX0
- FSX0
- J3 | Restliche Pins
- CLKR0
- FSR0
- Teile:
- 330µF: Nichion UWT0G331MCL1GS
- Restliche Pins
- 100µF: United Chemi-Con EMVE6R3ADA101MF55G
- Restliche Pins
- IO_2/MOSI/CSI_B | IO_L10N_2/D3
- IP_2/VREF_2 | IO_L11P_2/D2
- IO_L07N_2/D4 | IO_L11N_2/D1
- IO_L07P_2/D5 | IO_L02P_1/RHCLK0
- IO_L06N_2/D6 | IO_L02N_1/RHCLK1
- IO_L06P_2/D7 | IO_L03P_1/RHCLK2
- IO_L04N_2/VS0 | IO_L03N_1/TRDY1/RHCLK3
- IO_L04P_2/VS1 | IO_L04P_1/IRDY/RHCLK6
- IO_L03N_2/VS2 | IO_L04N_1/RHCLK7
- IO_L06P_0/VREF_0 | IO_L06N_0/PUDC_B
- IO_L05P_0 | IP_0
- IO_L03N_0/GCLK7 | IO_L04P_0/GCLK8
- IO_L02N_0/GCLK5 | IO_L03P_0/GCLK6
- IP_0/VREF_0 | IO_L02P_0/GCLK4
- IO_L01P_0/VREF_0 | IO_L01N_0
- IP_3/VREF_3 | IO_L04P_3/LHCLK2
- IO_L03N_3/LHCLK1 | IO_L03P_3/LHCLK0
- J3
- IP_1/VREF_1 | IP3

## Library data of the parts
C1-C26 C28 C31-C34 C36-C39 C41 C43 = rcl:C-EU: CAPACITOR, European symbol
C27 C29 C30 C35 C40 C42 C44 = SMD-ELKO:ELKO-SMD
IC1 = LD1117:LD1117: LD1117 800mA lowdrop voltage regulator Input: max 15V Fixed Output: 1.2, 1.8, 2.5, 3.3, 5.0V Adjustable version available; VOLTAGE: 1.2V
IC2 = Xilinx XCF02S:XCF02S-VO20/VOG20: XILINX 2 Mbit Platform Flash In-System Programmable Configuration PROM Symbol nach XAPP986 - "Bulletproof Configuration Guide for Spartan-3A FPGAs" Pinout nach DS123 Mit den Platform Flash-Chips von XILINX lassen sich die XILINX-FPGAs bequem Konfigurieren. In XAPP986 ist die Beschaltung dokumentiert, unter anderem kann der Chip direkt in die JTAG-Kette eingebunden werden, was das Programmieren erleichtert.
IC3-IC5 = 74xx:74*244: Octal BUFFER and LINE DRIVER, 3-state
J3_1 J3_2 = TI_6455Board:J3_2X40SMD127
JP1 = pinhead:PINHD-1X8: PIN HEADER
L1-L9 = rcl:L-EU: INDUCTOR, European symbol
LED_FRAMEERR_1-LED_FRAMEERR_3 LED_FRAMEOK-1-LED_FRAMEOK-3 LED_KANAL_AKTIV_1-LED_KANAL_AKTIV_3 LED_KANAL_INAKTIV_1-LED_KANAL_INAKTIV_3 LED_LEBTNOCH LED_POWER_1V2 LED_PUFFER_LEER LED_PUFFER_NORMAL LED_PUFFER_UNTERLAUF LED_PUFFER_VOLL LED_PUFFER_ÜBERLAUF = led:LED: LED OSRAM: - CHIPLED LG R971, LG N971, LY N971, LG Q971, LY Q971, LO R971, LY R971 LH N974, LH R974 LS Q976, LO Q976, LY Q976 LO Q996 - Hyper CHIPLED LW Q18S LB Q993, LB Q99A, LB R99A - SideLED LS A670, LO A670, LY A670, LG A670, LP A670 LB A673, LV A673, LT A673, LW A673 LH A674 LY A675 LS A676, LA A676, LO A676, LY A676, LW A676 LS A679, LY A679, LG A679 - Hyper Micro SIDELED® LS Y876, LA Y876, LO Y876, LY Y876 LT Y87S - SmartLED LW L88C, LW L88S LB L89C, LB L89S, LG L890 LS L89K, LO L89K, LY L89K LS L896, LA L896, LO L896, LY L896 - TOPLED LS T670, LO T670, LY T670, LG T670, LP T670 LSG T670, LSP T670, LSY T670, LOP T670, LYG T670 LG T671, LOG T671, LSG T671 LB T673, LV T673, LT T673, LW T673 LH T674 LS T676, LA T676, LO T676, LY T676, LB T676, LH T676, LSB T676, LW T676 LB T67C, LV T67C, LT T67C, LS T67K, LO T67K, LY T67K, LW E67C LS E67B, LA E67B, LO E67B, LY E67B, LB E67C, LV E67C, LT E67C LW T67C LS T679, LY T679, LG T679 LS T770, LO T770, LY T770, LG T770, LP T770 LB T773, LV T773, LT T773, LW T773 LH T774 LS E675, LA E675, LY E675, LS T675 LS T776, LA T776, LO T776, LY T776, LB T776 LHGB T686 LT T68C, LB T68C - Hyper Mini TOPLED® LB M676 - Mini TOPLED Santana® LG M470 LS M47K, LO M47K, LY M47K Source: http://www.osram.convergy.de LUXEON: - LUMILED® LXK2-PW12-R00, LXK2-PW12-S00, LXK2-PW14-U00, LXK2-PW14-V00 LXK2-PM12-R00, LXK2-PM12-S00, LXK2-PM14-U00 LXK2-PE12-Q00, LXK2-PE12-R00, LXK2-PE12-S00, LXK2-PE14-T00, LXK2-PE14-U00 LXK2-PB12-K00, LXK2-PB12-L00, LXK2-PB12-M00, LXK2-PB14-N00, LXK2-PB14-P00, LXK2-PB14-Q00 LXK2-PR12-L00, LXK2-PR12-M00, LXK2-PR14-Q00, LXK2-PR14-R00 LXK2-PD12-Q00, LXK2-PD12-R00, LXK2-PD12-S00 LXK2-PH12-R00, LXK2-PH12-S00 LXK2-PL12-P00, LXK2-PL12-Q00, LXK2-PL12-R00 Source: www.luxeon.com KINGBRIGHT: KA-3528ASYC Source: www.kingbright.com
OPT_RX_1-OPT_RX_3 = Everligth Photolink Fiber Optic Receivers and Transmitters:PLR135
OPT_TX_1-OPT_TX_3 = Everligth Photolink Fiber Optic Receivers and Transmitters:PLT133
PULLUP_CE PULLUP_CF PULLUP_RESET R1-R42 = rcl:R-EU_: RESISTOR, European symbol
Q1 Q2 = crystal:ASF*: CRYSTAL CLOCK OSCILLATORS 5.0 Vdc or 3.3 Vdc - LOW PROFILE ULTRA MINIATURE CERAMIC SURFACE MOUNT Source: http://www.abracon.com/Oscillators/asf1-L-L1.pdf
SV1 SV2 = con-harting-ml_RUNDE PAds:ML20_ROUND-PADS: HARTING
SV3 = con-harting-ml_RUNDE PAds:ML14_RUNDE-PINS: HARTING
SV4 = Molex:87831-14: Molex 87831 Wannenstecker, 14-Pins
SW1 = special:SW_DIP-3: DIP SWITCH
SW2 = special:SW_DIP-2: DIP SWITCH
T1-T19 = transistor:BC847: NPN TRANSISTOR
TP1 TP2 = testpad:PTR1: TEST PIN
TP_1-TP_3 TP_3V3 TP_4 TP_GND TP_GND1 TP_GND4-TP_GND6 TP_IO_L03N_1/TRDY1/RHCLK3 TP_IO_L04N_1/RHCLK7 TP_IO_L04N_2/VS0 TP_IO_L04P_1/IRDY/RHCLK6 TP_IO_L04P_2/VS1 TP_VCCINT = PCB-Helper:TESTPOINT
TP_ADAT_3V3 TP_ADAT_3V3_ANALOG TP_ADAT_GND TP_ADAT_GND_ANALOG TP_EINGANG_3V3 TP_EINGANG_GND TP_FPGA_1V2 TP_FPGA_3V3 TP_FPGA_GND TP_GEREGELT_1V2 TP_TAKT_50MHZ TP_TAKT_ADAT = testpad:TP: Test pad
U1 = OLIMEX_IC:XC3S200A
U$1-U$3 = Tyco-Electronics:B6252H7NPP3G75T
VCC9 = DSP-ADAT-Interface:PINHEAD_2X40SMD127
VCC10 = DSP-ADAT-Interface:PINHEAD_2X40SMD127BOTTOM